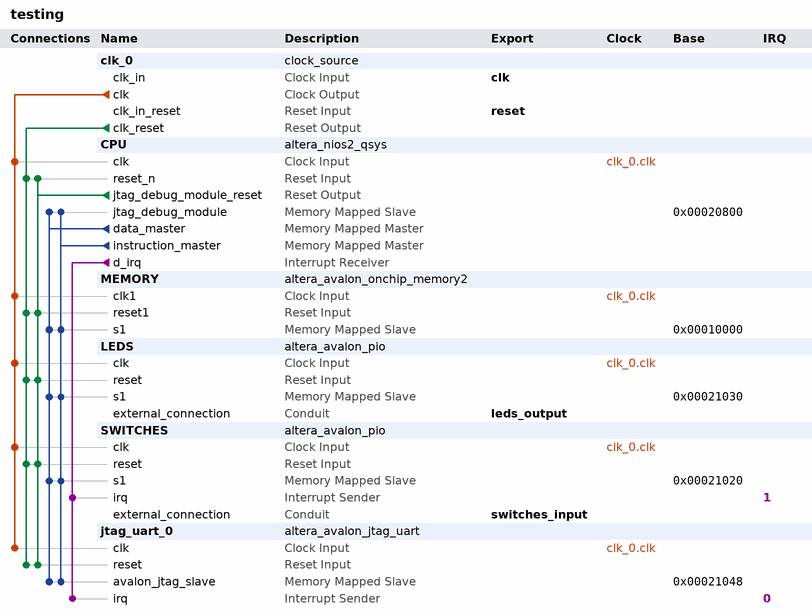
[diagram p0: system contents]
# Platform Designer (Qsys) system testing, Cyclone IV E EP4CE22F17C6
# Parameters at their usual value, and those the tool derives, are not listed.
package require -exact qsys 13.1
create_system testing
set_project_property DEVICE_FAMILY {Cyclone IV E}
set_project_property DEVICE EP4CE22F17C6

add_instance clk_0 clock_source 13.1
set_instance_parameter_value clk_0 clockFrequency 50000000

add_instance CPU altera_nios2_qsys 13.1
set_instance_parameter_value CPU resetSlave MEMORY.s1
set_instance_parameter_value CPU mmu_TLBMissExcSlave None
set_instance_parameter_value CPU exceptionSlave MEMORY.s1
set_instance_parameter_value CPU breakSlave CPU.jtag_debug_module
set_instance_parameter_value CPU impl Small
set_instance_parameter_value CPU icache_size 4096

add_instance MEMORY altera_avalon_onchip_memory2 13.1
set_instance_parameter_value MEMORY dataWidth 32
set_instance_parameter_value MEMORY dualPort false
set_instance_parameter_value MEMORY initMemContent true
set_instance_parameter_value MEMORY initializationFileName onchip_mem.hex
set_instance_parameter_value MEMORY memorySize 65535

add_instance LEDS altera_avalon_pio 13.1
set_instance_parameter_value LEDS direction Output
set_instance_parameter_value LEDS width 8

add_instance SWITCHES altera_avalon_pio 13.1
set_instance_parameter_value SWITCHES captureEdge true
set_instance_parameter_value SWITCHES direction Input
set_instance_parameter_value SWITCHES edgeType ANY
set_instance_parameter_value SWITCHES generateIRQ true
set_instance_parameter_value SWITCHES irqType EDGE
set_instance_parameter_value SWITCHES width 8

add_instance jtag_uart_0 altera_avalon_jtag_uart 13.1
set_instance_parameter_value jtag_uart_0 simInteractiveOptions NO_INTERACTIVE_WINDOWS

# connections
add_connection clk_0.clk CPU.clk clock
add_connection clk_0.clk jtag_uart_0.clk clock
add_connection clk_0.clk LEDS.clk clock
add_connection clk_0.clk MEMORY.clk1 clock
add_connection clk_0.clk SWITCHES.clk clock
add_connection clk_0.clk_reset CPU.reset_n reset
add_connection clk_0.clk_reset jtag_uart_0.reset reset
add_connection clk_0.clk_reset LEDS.reset reset
add_connection clk_0.clk_reset MEMORY.reset1 reset
add_connection clk_0.clk_reset SWITCHES.reset reset
add_connection CPU.jtag_debug_module_reset CPU.reset_n reset
add_connection CPU.jtag_debug_module_reset jtag_uart_0.reset reset
add_connection CPU.jtag_debug_module_reset LEDS.reset reset
add_connection CPU.jtag_debug_module_reset MEMORY.reset1 reset
add_connection CPU.jtag_debug_module_reset SWITCHES.reset reset
add_connection CPU.data_master CPU.jtag_debug_module avalon
set_connection_parameter_value CPU.data_master/CPU.jtag_debug_module baseAddress 0x00020800
add_connection CPU.data_master jtag_uart_0.avalon_jtag_slave avalon
set_connection_parameter_value CPU.data_master/jtag_uart_0.avalon_jtag_slave baseAddress 0x00021048
add_connection CPU.data_master LEDS.s1 avalon
set_connection_parameter_value CPU.data_master/LEDS.s1 baseAddress 0x00021030
add_connection CPU.data_master MEMORY.s1 avalon
set_connection_parameter_value CPU.data_master/MEMORY.s1 baseAddress 0x00010000
add_connection CPU.data_master SWITCHES.s1 avalon
set_connection_parameter_value CPU.data_master/SWITCHES.s1 baseAddress 0x00021020
add_connection CPU.instruction_master CPU.jtag_debug_module avalon
set_connection_parameter_value CPU.instruction_master/CPU.jtag_debug_module baseAddress 0x00020800
add_connection CPU.instruction_master jtag_uart_0.avalon_jtag_slave avalon
set_connection_parameter_value CPU.instruction_master/jtag_uart_0.avalon_jtag_slave baseAddress 0x00021048
add_connection CPU.instruction_master LEDS.s1 avalon
set_connection_parameter_value CPU.instruction_master/LEDS.s1 baseAddress 0x00021030
add_connection CPU.instruction_master MEMORY.s1 avalon
set_connection_parameter_value CPU.instruction_master/MEMORY.s1 baseAddress 0x00010000
add_connection CPU.instruction_master SWITCHES.s1 avalon
set_connection_parameter_value CPU.instruction_master/SWITCHES.s1 baseAddress 0x00021020
add_connection CPU.d_irq jtag_uart_0.irq interrupt
set_connection_parameter_value CPU.d_irq/jtag_uart_0.irq irqNumber 0
add_connection CPU.d_irq SWITCHES.irq interrupt
set_connection_parameter_value CPU.d_irq/SWITCHES.irq irqNumber 1

# exported interfaces
add_interface clk clock sink
set_interface_property clk EXPORT_OF clk_0.clk_in
add_interface reset reset sink
set_interface_property reset EXPORT_OF clk_0.clk_in_reset
add_interface leds_output conduit end
set_interface_property leds_output EXPORT_OF LEDS.external_connection
add_interface switches_input conduit end
set_interface_property switches_input EXPORT_OF SWITCHES.external_connection

set_interconnect_requirement {$system} qsys_mm.clockCrossingAdapter HANDSHAKE
set_interconnect_requirement {$system} qsys_mm.maxAdditionalLatency 1
set_interconnect_requirement {$system} qsys_mm.insertDefaultSlave false

save_system testing.qsys
